# Altium schematic sheet Schematic.SchDoc
size A
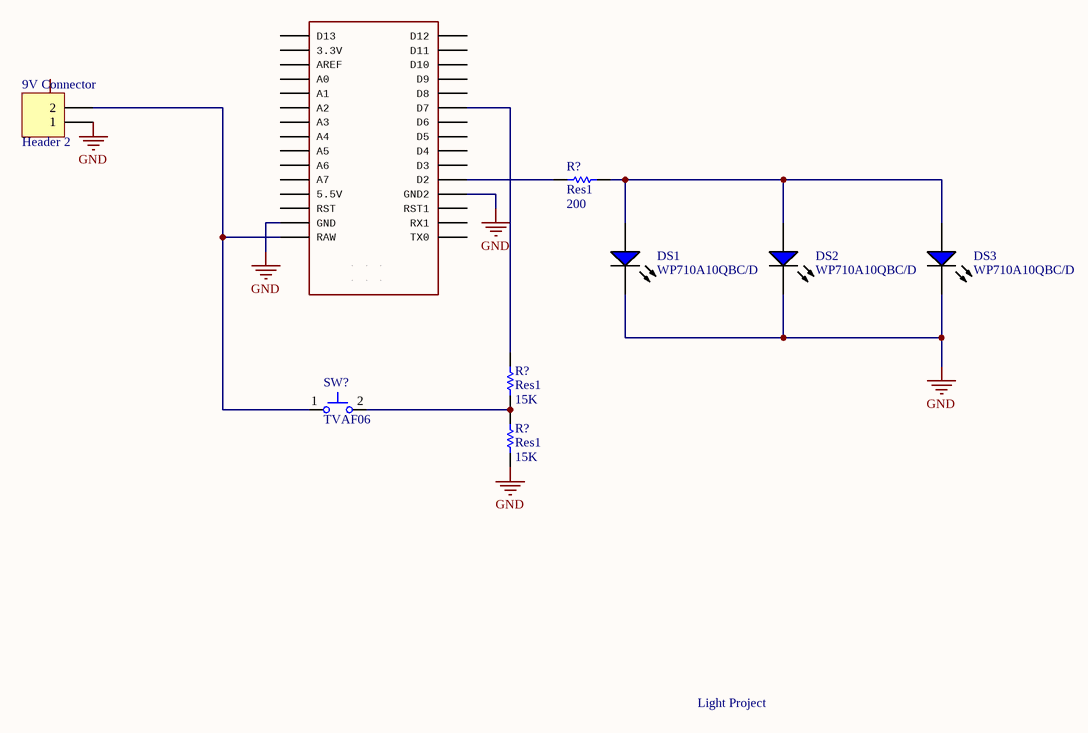
[diagram p0: Schematic.SchDoc]

## Parts
(Parts that share a designator on the sheet are numbered #1, #2 ... from top to bottom, then left to right.)
9V_Connector  Header 2  [HDR1X2]
?  Arduino Nano  [NANO]  (value not drawn)
DS1  WP710A10QBC/D  [KING-WP710A10QBCD_V]
DS2  WP710A10QBC/D  [KING-WP710A10QBCD_V]
DS3  WP710A10QBC/D  [KING-WP710A10QBCD_V]
R?#1  Res1  value 200  [AXIAL-0.3]
R?#2  Res1  value 15K  [AXIAL-0.3]
R?#3  Res1  value 15K  [AXIAL-0.3]
SW?  TVAF06  [JNFU-TVAF06_V]

## Nets
GND: 9V_Connector.1 ?.GND ?.GND1(GND2) DS1.2(K) DS2.2(K) DS3.2(K) R?#3.1
Net9V_Connector_2: 9V_Connector.2 ?.RAW SW?.1
Net?_D2: ?.D2 R?#1.1
Net?_D7: ?.D7 R?#2.2
NetDS1_1: DS1.1(A) DS2.1(A) DS3.1(A) R?#1.2
NetR?#2_1: R?#2.1 R?#3.2 SW?.2

Not connected (* = marked no-connect by the designer): ? 3.3V 5V(5.5V) A0 A1 A2 A3 A4 A5 A6 A7 AREF D3 D4 D5 D6 D8 D9 D10 D11 D12 D13 ICSP1 ICSP2 ICSP3 ICSP4 ICSP5 ICSP6 RST RST1 RX1 TX0

## Notes on the sheet
- Light Project
- Labels drawn without touching a wire or pin: GND

## Library data of the parts
9V_Connector = Header 2: Header, 2-Pin; LatestRevisionDate: 17-Jul-2002; LatestRevisionNote: Re-released for DXP Platform.; Publisher: Altium Limited
? = NANO: GateName_1: G$1; SymbolName_1: NANO; LibraryName: Arduino-clone; DeviceSetName: NANO; Package: NANO
DS1-DS3 = CMP-2000-07416-1: Blue LED, 3.3 V, 20 mA, -40 to 85 degC, 2-Pin THD, RoHS, Bulk; Manufacturer: Kingbright; Forward Current: 20mA; LED Size: T-1; Viewing Angle: 20deg; Lens Color/Style: WaterClear; Wavelength/Color Temperature: 470nm; Forward Voltage: 3.3V; Luminous Intensity: 1600mcd; Lens Shape: Dome; Type: SolidStateLEDLamp; Minimum Operating Temperature: -40C; Package Description: 2-Pin Through Hole Device, Dia 3.2 mm; Packaging: Bulk; Maximum Operating Temperature: +85C; Factory Pack Quantity: 500; Mounting Technology: ThroughHole; Datasheet URL: https://datasheet.ciiva.com/2121/wp710a10qbc-d-2121617.pdf; Datasheet Version: Rev. 5B, 09/2014; Package Reference: WP710A10QBCD; Lens Dimensions: 3mmx4.6mm; Product Category: StandardLEDs-ThroughHole; Manufacturer URL: http://www.kingbright.com/; Mounting Style: ThroughHole; RoHS: Details; Illumination Color: Blue
R?#1-R?#3 = Res1: Resistor; Published: 8-Jun-2000; LatestRevisionDate: 17-Jul-2002; LatestRevisionNote: Re-released for DXP Platform.; PackageReference: AXIAL-0.3; Publisher: Altium Limited; PackageDescription: Axial Device, Thru-Hole; 2 Leads; 0.3 in Pin Spacing
SW? = CMP-0587-00001-2: Switch, SPST Push Button, 50 mA, 12 V DC, SMD, -30 to 85 degC, RoHS; Manufacturer: Jianfu; Contact Resistance: 100 mW max; Lifetime: 100000 Cycles min; Rating: 50 mA. 12 V DC; Insulation Resistance: 100 MW min. 100 V DC; Travel: 0.13 +/- 0.05 mm; Dielectric Strength: 250 V AC for 1 min; RoHS: TRUE; Mounting Technology: Surface Mount; PartNumber: TVAF06; PackageDescription: 2-Pin Switch, Push Button, SMD, Body 2.9 x 3.9 mm; ComponentLink1Description: Manufacturer URL; ComponentLink1URL: http://www.jian-fu.com/; Operating Temperature: -30 to 85 degC; ComponentLink2URL: http://en.jian-fu.com/product-22.html; PackageReference: TVAF06; ComponentLink2Description: Datasheet